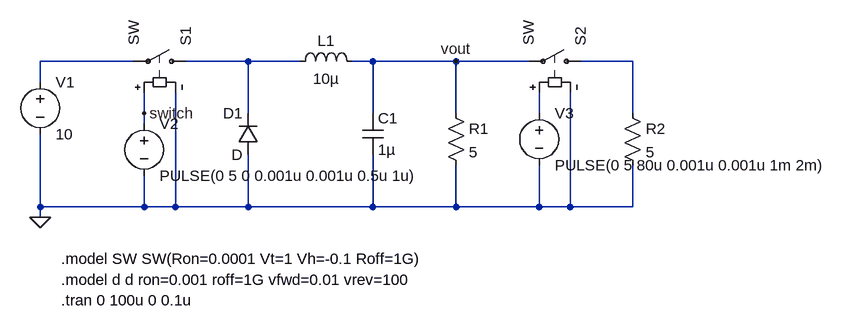
[diagram p0: schematic ideal-buck.asc]
ideal-buck.asc, the LTspice schematic file:
Version 4
SHEET 1 1224 680
WIRE 128 112 -16 112
WIRE 304 112 208 112
WIRE 384 112 304 112
WIRE 496 112 464 112
WIRE 624 112 496 112
WIRE 736 112 624 112
WIRE 896 112 816 112
WIRE -16 144 -16 112
WIRE 144 192 144 160
WIRE 304 192 304 112
WIRE 496 192 496 112
WIRE 624 192 624 112
WIRE 752 192 752 160
WIRE 896 192 896 112
WIRE 144 208 144 192
WIRE -16 336 -16 224
WIRE 144 336 144 288
WIRE 144 336 -16 336
WIRE 192 336 192 160
WIRE 192 336 144 336
WIRE 304 336 304 256
WIRE 304 336 192 336
WIRE 496 336 496 256
WIRE 496 336 304 336
WIRE 624 336 624 272
WIRE 624 336 496 336
WIRE 752 336 752 272
WIRE 752 336 624 336
WIRE 800 336 800 160
WIRE 800 336 752 336
WIRE 896 336 896 272
WIRE 896 336 800 336
WIRE -16 352 -16 336
FLAG -16 352 0
FLAG 624 112 vout
FLAG 144 192 switch
SYMBOL voltage -16 128 R0
WINDOW 123 0 0 Left 0
WINDOW 39 0 0 Left 0
SYMATTR InstName V1
SYMATTR Value 10
SYMBOL voltage 144 192 R0
WINDOW 123 0 0 Left 0
WINDOW 39 0 0 Left 0
SYMATTR InstName V2
SYMATTR Value PULSE(0 5 0 0.001u 0.001u 0.5u 1u)
SYMBOL ind 368 128 R270
WINDOW 0 32 56 VTop 2
WINDOW 3 5 56 VBottom 2
SYMATTR InstName L1
SYMATTR Value 10µ
SYMBOL sw 224 112 M270
SYMATTR InstName S1
SYMBOL cap 480 192 R0
SYMATTR InstName C1
SYMATTR Value 1µ
SYMBOL res 608 176 R0
SYMATTR InstName R1
SYMATTR Value 5
SYMBOL diode 320 256 R180
WINDOW 0 24 64 Left 2
WINDOW 3 24 0 Left 2
SYMATTR InstName D1
SYMBOL sw 832 112 M270
SYMATTR InstName S2
SYMBOL voltage 752 176 R0
WINDOW 123 0 0 Left 0
WINDOW 39 0 0 Left 0
SYMATTR InstName V3
SYMATTR Value PULSE(0 5 80u 0.001u 0.001u 1m 2m)
SYMBOL res 880 176 R0
SYMATTR InstName R2
SYMATTR Value 5
TEXT 16 416 Left 2 !.model SW SW(Ron=0.0001 Vt=1 Vh=-0.1 Roff=1G)
TEXT 16 448 Left 2 !.model d d ron=0.001 roff=1G vfwd=0.01 vrev=100
TEXT 16 480 Left 2 !.tran 0 100u 0 0.1u

The netlist it stands for:
* ideal-buck.asc
V1 N001 0 10
V2 switch 0 PULSE(0 5 0 0.001u 0.001u 0.5u 1u)
L1 N002 vout 10µ
S1 N002 N001 switch 0 SW
C1 vout 0 1µ
R1 vout 0 5
D1 0 N002 D
S2 N003 vout N004 0 SW
V3 N004 0 PULSE(0 5 80u 0.001u 0.001u 1m 2m)
R2 N003 0 5
.model D D
.lib standard.dio
.model SW SW(Ron=0.0001 Vt=1 Vh=-0.1 Roff=1G)
.model d d ron=0.001 roff=1G vfwd=0.01 vrev=100
.tran 0 100u 0 0.1u
.backanno
.end